# EAGLE schematic board (EAGLE 6.3)
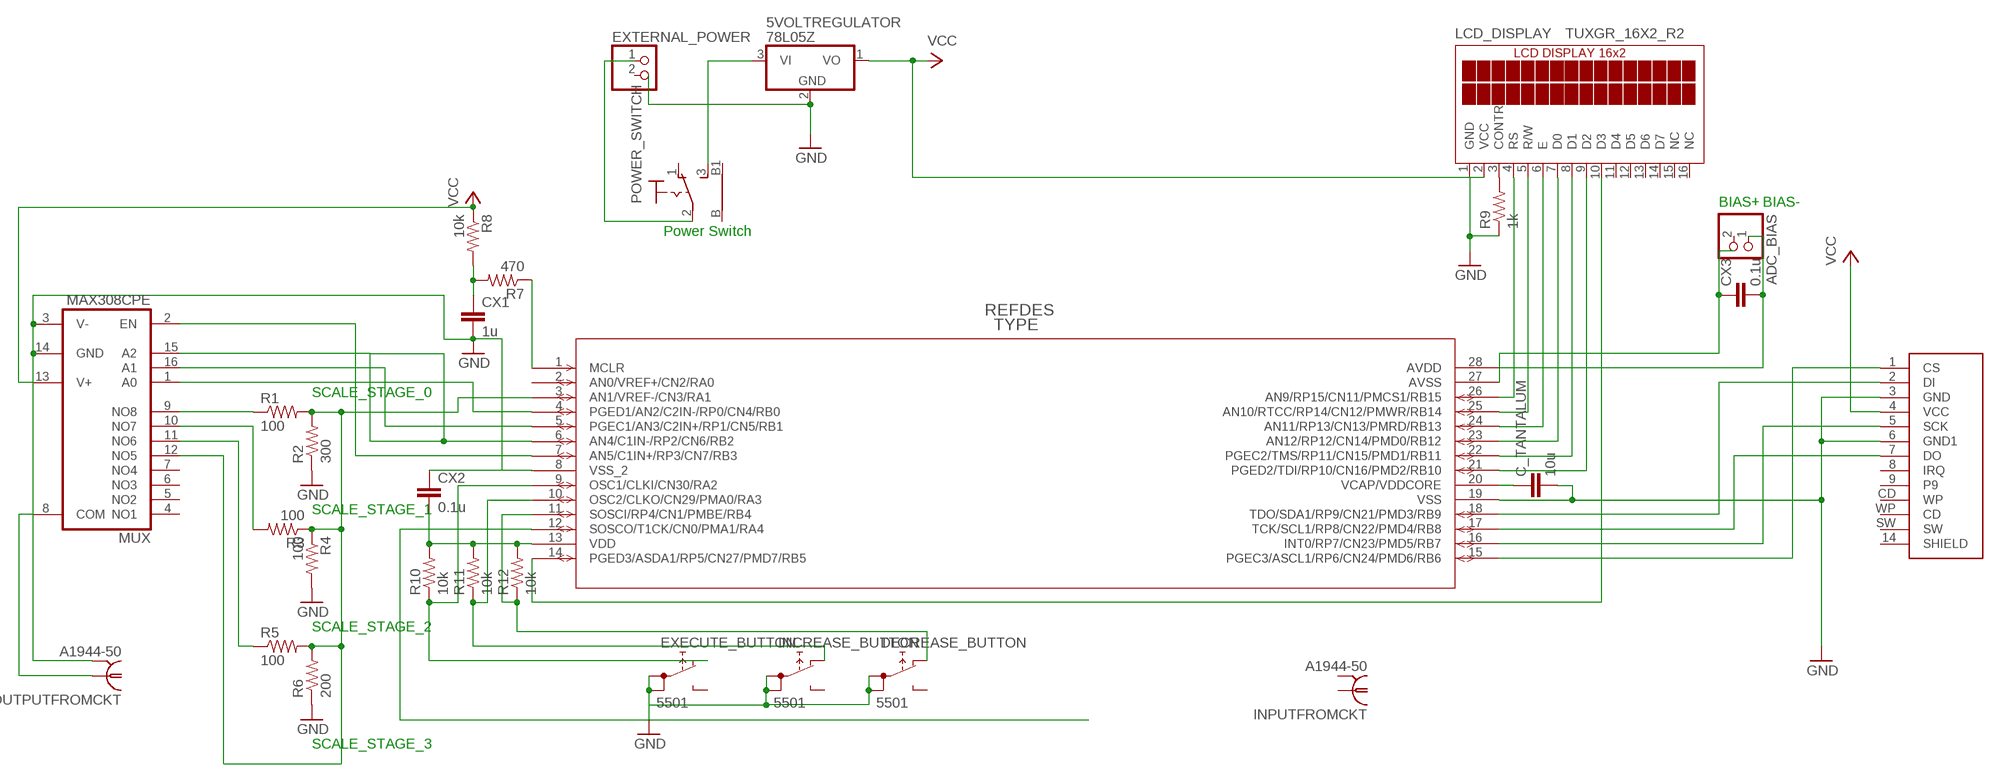
[diagram p0: schematic, sheet 1]

## Parts
5VOLTREGULATOR  78L05Z  [TO92]
ADC_BIAS  PINHD-1X2/90  [1X02/90]
C_TANTALUM  10u  CXXC10B5  [XC10B5]
CX1  1u  CXXC10B5  [XC10B5]
CX2  0.1u  CXXC10B5  [XC10B5]
CX3  0.1u  CXXC10B5  [XC10B5]
DECREASE_BUTTON  5501  [5501]
EXECUTE_BUTTON  5501  [5501]
EXTERNAL_POWER  PINHD-1X2/90  [1X02/90]
INCREASE_BUTTON  5501  [5501]
INPUTFROMCKT  A1944-50  [A1944]
LCD_DISPLAY  TUXGR_16X2_R2  [TUXGR_16X2_R2]
MUX  MAX308CPE  [DIL16]
OUTPUTFROMCKT  A1944-50  [A1944]
PIC24HJ128GP502  PIC24HJ128GP502_  [SPDIP28_300MC]
POWER_SWITCH  316-917  [316-917]
R1  100  R-US_0204/2V  [0204V]
R2  300  R-US_0204/2V  [0204V]
R3  100  R-US_0204/2V  [0204V]
R4  100  R-US_0204/2V  [0204V]
R5  100  R-US_0204/2V  [0204V]
R6  200  R-US_0204/2V  [0204V]
R7  470  R-US_0204/7  [0204/7]
R8  10k  R-US_0204/7  [0204/7]
R9  1k  R-US_0204/2V  [0204V]
R10  10k  R-US_0204/2V  [0204V]
R11  10k  R-US_0204/2V  [0204V]
R12  10k  R-US_0204/2V  [0204V]
SDCARD  SD_CARD_SOCKETSD  [SD-MMC_SOCKET-PP]

## Nets
ADC: MUX.12(NO5) PIC24HJ128GP502.3(AN1/VREF-/CN3/RA1) R1.2 R2.2 R3.1 R4.1 R5.2 R6.2
ADC_BIAS+: CX3.1 PIC24HJ128GP502.28(AVDD)
ADC_BIAS-: ADC_BIAS.1 CX3.2 PIC24HJ128GP502.27(AVSS)
DECREASE_BUTTON: DECREASE_BUTTON.NC PIC24HJ128GP502.11(SOSCI/RP4/CN1/PMBE/RB4) R12.1
EXECUTE_BUTTON: EXECUTE_BUTTON.NC PIC24HJ128GP502.9(OSC1/CLKI/CN30/RA2) R10.1
GND: 5VOLTREGULATOR.2(GND) C_TANTALUM.2 CX1.2 CX2.1 DECREASE_BUTTON.1A DECREASE_BUTTON.1B EXECUTE_BUTTON.1A EXECUTE_BUTTON.1B INCREASE_BUTTON.1A INCREASE_BUTTON.1B LCD_DISPLAY.1(GND) MUX.3(V-) MUX.14(GND) OUTPUTFROMCKT.2(GND) PIC24HJ128GP502.8(VSS_2) PIC24HJ128GP502.19(VSS) R2.1 R4.2 R6.1 R9.1 SDCARD.3(GND) SDCARD.6(GND1)
INCREASE_BUTTON: INCREASE_BUTTON.NC PIC24HJ128GP502.10(OSC2/CLKO/CN29/PMA0/RA3) R11.1
LCD_D0: LCD_DISPLAY.7(D0) PIC24HJ128GP502.23(AN12/RP12/CN14/PMD0/RB12)
LCD_D1: LCD_DISPLAY.8(D1) PIC24HJ128GP502.22(PGEC2/TMS/RP11/CN15/PMD1/RB11)
LCD_D2: LCD_DISPLAY.9(D2) PIC24HJ128GP502.21(PGED2/TDI/RP10/CN16/PMD2/RB10)
LCD_D3: LCD_DISPLAY.10(D3) PIC24HJ128GP502.14(PGED3/ASDA1/RP5/CN27/PMD7/RB5)
LCD_E: LCD_DISPLAY.6(E) PIC24HJ128GP502.24(AN11/RP13/CN13/PMRD/RB13)
LCD_RS: LCD_DISPLAY.4(RS) PIC24HJ128GP502.26(AN9/RP15/CN11/PMCS1/RB15)
LCD_RW: LCD_DISPLAY.5(R/W) PIC24HJ128GP502.25(AN10/RTCC/RP14/CN12/PMWR/RB14)
MUX_0: MUX.1(A0) PIC24HJ128GP502.4(PGED1/AN2/C2IN-/RP0/CN4/RB0)
MUX_1: MUX.16(A1) PIC24HJ128GP502.5(PGEC1/AN3/C2IN+/RP1/CN5/RB1)
MUX_2: MUX.15(A2) PIC24HJ128GP502.6(AN4/C1IN-/RP2/CN6/RB2)
MUX_EN: MUX.2(EN) PIC24HJ128GP502.7(AN5/C1IN+/RP3/CN7/RB3)
N$2: PIC24HJ128GP502.1(MCLR) R7.1
N$3: CX1.1 R7.2 R8.2
N$4: C_TANTALUM.1 PIC24HJ128GP502.20(VCAP/VDDCORE)
N$6: PIC24HJ128GP502.16(INT0/RP7/CN23/PMD5/RB7) SDCARD.5(SCK)
N$7: PIC24HJ128GP502.18(TDO/SDA1/RP9/CN21/PMD3/RB9) SDCARD.2(DI)
N$8: PIC24HJ128GP502.17(TCK/SCL1/RP8/CN22/PMD4/RB8) SDCARD.7(DO)
N$9: PIC24HJ128GP502.15(PGEC3/ASCL1/RP6/CN24/PMD6/RB6) SDCARD.1(CS)
N$10: CX2.2 PIC24HJ128GP502.13(VDD) R10.2 R11.2 R12.2
N$18: 5VOLTREGULATOR.3(VI) POWER_SWITCH.3(S)
N$21: EXTERNAL_POWER.1 POWER_SWITCH.2(P)
N$27: LCD_DISPLAY.3(CONTR) R9.2
OUTPUT_CKT: MUX.8(COM) OUTPUTFROMCKT.1
SCALE_0: MUX.9(NO8) R1.1
SCALE_1: MUX.10(NO7) R3.2
SCALE_2: MUX.11(NO6) R5.1
VCC: 5VOLTREGULATOR.1(VO) LCD_DISPLAY.2(VCC) MUX.13(V+) R8.1 SDCARD.4(VCC)
VCO: PIC24HJ128GP502.12(SOSCO/T1CK/CN0/PMA1/RA4)
Unconnected: ADC_BIAS.2 DECREASE_BUTTON.NO EXECUTE_BUTTON.NO EXTERNAL_POWER.2 INCREASE_BUTTON.NO INPUTFROMCKT.1 LCD_DISPLAY.11(D4) LCD_DISPLAY.12(D5) LCD_DISPLAY.13(D6) LCD_DISPLAY.14(D7) LCD_DISPLAY.15(NC) LCD_DISPLAY.16(NC) MUX.4(NO1) MUX.5(NO2) MUX.6(NO3) MUX.7(NO4) PIC24HJ128GP502.2(AN0/VREF+/CN2/RA0) POWER_SWITCH.1(O) POWER_SWITCH.B POWER_SWITCH.B1 SDCARD.8(IRQ) SDCARD.9 SDCARD.14(SHIELD) SDCARD.CD(WP) SDCARD.SW SDCARD.WP(CD)

## Notes on the sheet
- BIAS+ | BIAS-
- Power Switch
- SCALE_STAGE_0
- SCALE_STAGE_1
- SCALE_STAGE_2
- SCALE_STAGE_3

## Power pins joined to a net without a drawn wire
GND: INPUTFROMCKT.2(GND) INPUTFROMCKT.3(GND) INPUTFROMCKT.4(GND) INPUTFROMCKT.5(GND) OUTPUTFROMCKT.3(GND) OUTPUTFROMCKT.4(GND) OUTPUTFROMCKT.5(GND)

## Library data of the parts
5VOLTREGULATOR = linear:78*: Positive VOLTAGE REGULATOR Source: http://cache.national.com/ds/LM/LM78L05.pdf http://www.fairchildsemi.com/ds/LM/LM7805.pdf
ADC_BIAS EXTERNAL_POWER = pinhead:PINHD-1X2: PIN HEADER
C_TANTALUM CX1-CX3 = resistor:CX: X CAPACITOR for power line
DECREASE_BUTTON EXECUTE_BUTTON INCREASE_BUTTON = switch:55?: PUSHBUTTON SERIES 5500 SWITCHES Source: www.e-switch.com .. 5500.pdf
INPUTFROMCKT OUTPUTFROMCKT = con-coax:A1944-50: BNC CONNECTOR 50 Ohm distributor Buerklin 78F2475; OC_FARNELL: unknown; OC_NEWARK: unknown
LCD_DISPLAY = display-lcd:TUXGR_16X2_R2: Tuxgraphics LCD display 16x2 characters reflective, without background light Source: tuxgr_12x2_r2.pdf; OC_FARNELL: unknown; OC_NEWARK: unknown
MUX = maxim:MAX308CPE: MULTIPLEXER; MF: MAXIM; MPN: MAX308CPE+; OC_FARNELL: 1379903; OC_NEWARK: 67K4639
PIC24HJ128GP502 = PIC24HJ128GP502DIP:PIC24HJ128GP502_
POWER_SWITCH = switch:316-917: TOGGLE SWITCH Mors, distributor RS Components
R1-R6 R10-R12 = rcl:R-US_: RESISTOR, American symbol
R7-R9 = resistor:R-US_: RESISTOR, American symbol
SDCARD = SparkFun:SD_CARD_SOCKET: SD/MMC Socket Media socket for SD and MMC cards. Push-push type. Schematic element and footprint production proven. Spark Fun Electronics SKU : PRT-00136